# EAGLE design LDecNUC100_64_B (EAGLE 5.06)

## Sheet 1 of 3
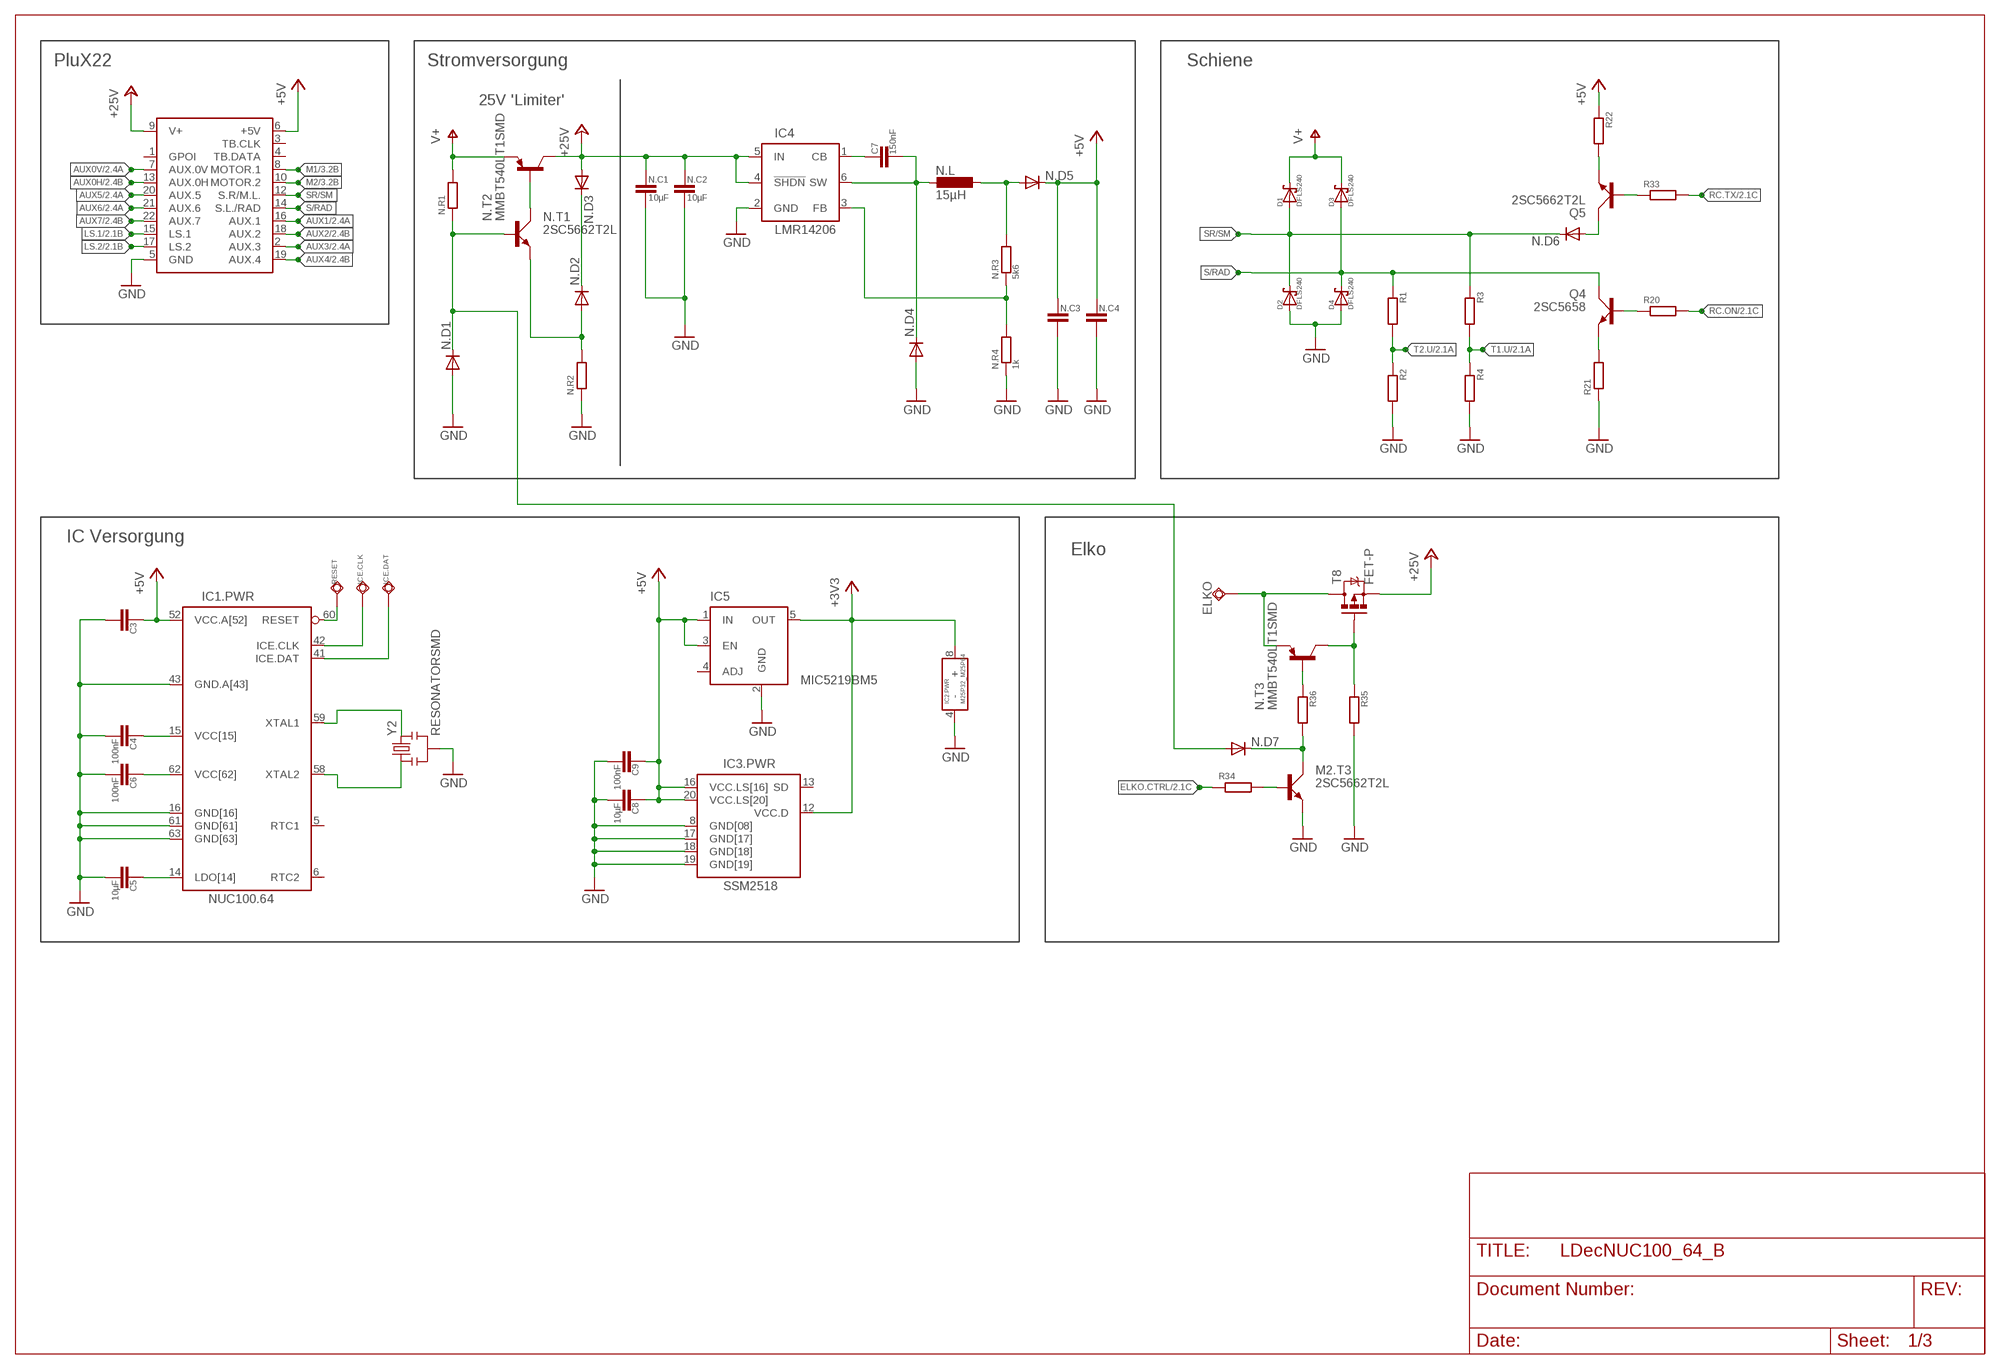
[diagram p0: schematic, sheet 1]

### Parts
C3  C-EUC0402  [C0402]
C4  100nF  C-EUC0402  [C0402]
C5  10µF  C-EUC0603  [C0603]
C6  100nF  C-EUC0402  [C0402]
C7  150nF  C-EUC0402  [C0402]
C8  10µF  C-EUC0603  [C0603]
C9  100nF  C-EUC0402  [C0402]
D1  DFLS240  [DFLS]
D2  DFLS240  [DFLS]
D3  DFLS240  [DFLS]
D4  DFLS240  [DFLS]
ELKO  TPSQTP08SQ  [TP08SQ]
IC1  NUC100.64  NUC100.6410X10  [LPQFP64.10X10]
IC2  M25P32_M25P64  [MLP08]
IC3  SSM2518  [LFCP20]
IC4  LMR14206  [SOT23-6]
IC5  MIC5219BM5  [SOT23-5]
ICE.CLK  TPSQTP08SQ  [TP08SQ]
ICE.DAT  TPSQTP08SQ  [TP08SQ]
M2.T3  2SC5662T2L  [VMT3]
N.C1  10µF  C-EUC1210  [C1210]
N.C2  10µF  C-EUC1210  [C1210]
N.C3  C-EUC1210  [C1210]
N.C4  C-EUC1210  [C1210]
N.D1  DIODE-MICROMELF-W  [MICROMELF-W]
N.D2  DIODE-SOD523  [SOD523]
N.D3  DIODE-SOD523  [SOD523]
N.D4  DIODE-SOD523  [SOD523]
N.D5  DIODE-SOD523  [SOD523]
N.D6  DIODE-SOD523  [SOD523]
N.D7  DIODE-SOD523  [SOD523]
N.L  15µH  L-EUL2825P  [L2825P]
N.R1  R-EU_R0402  [R0402]
N.R2  R-EU_R0402  [R0402]
N.R3  5k6  R-EU_R0402  [R0402]
N.R4  1k  R-EU_R0402  [R0402]
N.T1  2SC5662T2L  [VMT3]
N.T2  MMBT540LT1SMD  [SOT23-BEC]
N.T3  MMBT540LT1SMD  [SOT23-BEC]
Q4  2SC5658  2SC3838T146  [SC59]
Q5  2SC5662T2L  [VMT3]
R1  R-EU_R0402  [R0402]
R2  R-EU_R0402  [R0402]
R3  R-EU_R0402  [R0402]
R4  R-EU_R0402  [R0402]
R20  R-EU_R0402  [R0402]
R21  R-EU_R0402  [R0402]
R22  R-EU_R0402  [R0402]
R33  R-EU_R0402  [R0402]
R34  R-EU_R0402  [R0402]
R35  R-EU_R0402  [R0402]
R36  R-EU_R0402  [R0402]
RESET  TPSQTP08SQ  [TP08SQ]
T8  FET-P  [SOT23-3]
X1  X-PLUX22  [X-PLUX22]
Y2  RESONATORSMD  [RESONATOR-SMD]

### Nets
+3V3: IC2.8(.PWR:+) IC3.12(.PWR:VCC.D) IC5.5(OUT)
+5V: C3.1 C8.1 C9.1 IC1.52(.PWR:VCC.A[52]) IC3.16(.PWR:VCC.LS[16]) IC3.20(.PWR:VCC.LS[20]) IC5.1(IN) IC5.3(EN) N.C3.1 N.C4.1 N.D5.C R22.1 X1.6(+5V) ; also sheet 2
+24V: IC4.4(!SHDN) IC4.5(IN) N.C1.1 N.C2.1 N.D3.A N.T2.C T8.2(S) X1.9(V+) ; supply symbol labelled +25V ; also sheet 3
AUX0H: X1.13(AUX.0H) ; also sheet 2
AUX0V: X1.7(AUX.0V) ; also sheet 2
AUX1: X1.16(AUX.1) ; also sheet 2
AUX2: X1.18(AUX.2) ; also sheet 2
AUX3: X1.2(AUX.3) ; also sheet 2
AUX4: X1.19(AUX.4) ; also sheet 2
AUX5: X1.20(AUX.5) ; also sheet 2
AUX6: X1.21(AUX.6) ; also sheet 2
AUX7: X1.22(AUX.7) ; also sheet 2
ELKO: ELKO.TP N.T3.E T8.3(D)
ELKO.CTRL: R34.1 ; also sheet 2
GND: C3.2 C4.2 C5.2 C6.2 C8.2 C9.2 D2.A D4.A IC1.16(.PWR:GND[16]) IC1.43(.PWR:GND.A[43]) IC1.61(.PWR:GND[61]) IC1.63(.PWR:GND[63]) IC2.4(.PWR:-) IC3.8(.PWR:GND[08]) IC3.17(.PWR:GND[17]) IC3.18(.PWR:GND[18]) IC3.19(.PWR:GND[19]) IC4.2(GND) IC5.2(GND) M2.T3.E N.C1.2 N.C2.2 N.C3.2 N.C4.2 N.D1.A N.D4.A N.R2.1 N.R4.1 R2.2 R4.2 R21.1 R35.2 X1.5(GND) Y2.2 ; also sheet 2,3
LS.1: X1.15(LS.1) ; also sheet 2
LS.2: X1.17(LS.2) ; also sheet 2
M1: X1.8(MOTOR.1) ; also sheet 3
M2: X1.10(MOTOR.2) ; also sheet 3
N$5: IC1.58(.PWR:XTAL2) Y2.1
N$19: C4.1 IC1.15(.PWR:VCC[15])
N$22: IC1.60(.PWR:RESET) RESET.TP
N$23: IC1.42(.PWR:ICE.CLK) ICE.CLK.TP
N$25: IC1.41(.PWR:ICE.DAT) ICE.DAT.TP
N$28: C7.1 IC4.1(CB)
N$29: N.T1.C N.T2.B
N$31: N.D1.C N.D7.A N.R1.1 N.T1.B
N$32: N.D2.C N.D3.C
N$33: N.D2.A N.R2.2 N.T1.E
N$34: N.D5.A N.L.1 N.R3.2
N$36: IC4.3(FB) N.R3.1 N.R4.2
N$37: C6.1 IC1.62(.PWR:VCC[62])
N$48: C7.2 IC4.6(SW) N.D4.C N.L.2
N$54: C5.1 IC1.14(.PWR:LDO[14])
N$56: IC1.59(.PWR:XTAL1) Y2.3
N$64: Q4.E R21.2
N$65: Q4.B R20.1
N$66: N.D6.A Q5.C
N$67: Q5.E R22.2
N$68: Q5.B R33.1
N$69: M2.T3.B R34.2
N$70: N.T3.C R35.1 T8.1(G)
N$71: N.T3.B R36.1
N$72: M2.T3.C N.D7.C R36.2
RC.ON: R20.2 ; also sheet 2
RC.TX: R33.2 ; also sheet 2
S/RAD: D3.A D4.K(C) Q4.C R1.1 X1.14(S.L./RAD)
SR/SM: D1.A D2.K(C) N.D6.C R3.1 X1.12(S.R/M.L.)
T1.U: R3.2 R4.1 ; also sheet 2
T2.U: R1.2 R2.1 ; also sheet 2
V+: D1.K(C) D3.K(C) N.R1.2 N.T2.E
Unconnected: IC1.5(.PWR:RTC1) IC1.6(.PWR:RTC2) IC3.13(.PWR:SD) IC5.4(ADJ) X1.1(GPOI) X1.3(TB.CLK) X1.4(TB.DATA)

### Notes on the sheet
- PluX22 | Stromversorgung | Schiene
- 25V 'Limiter'
- IC Versorgung
- Elko

## Sheet 2 of 3
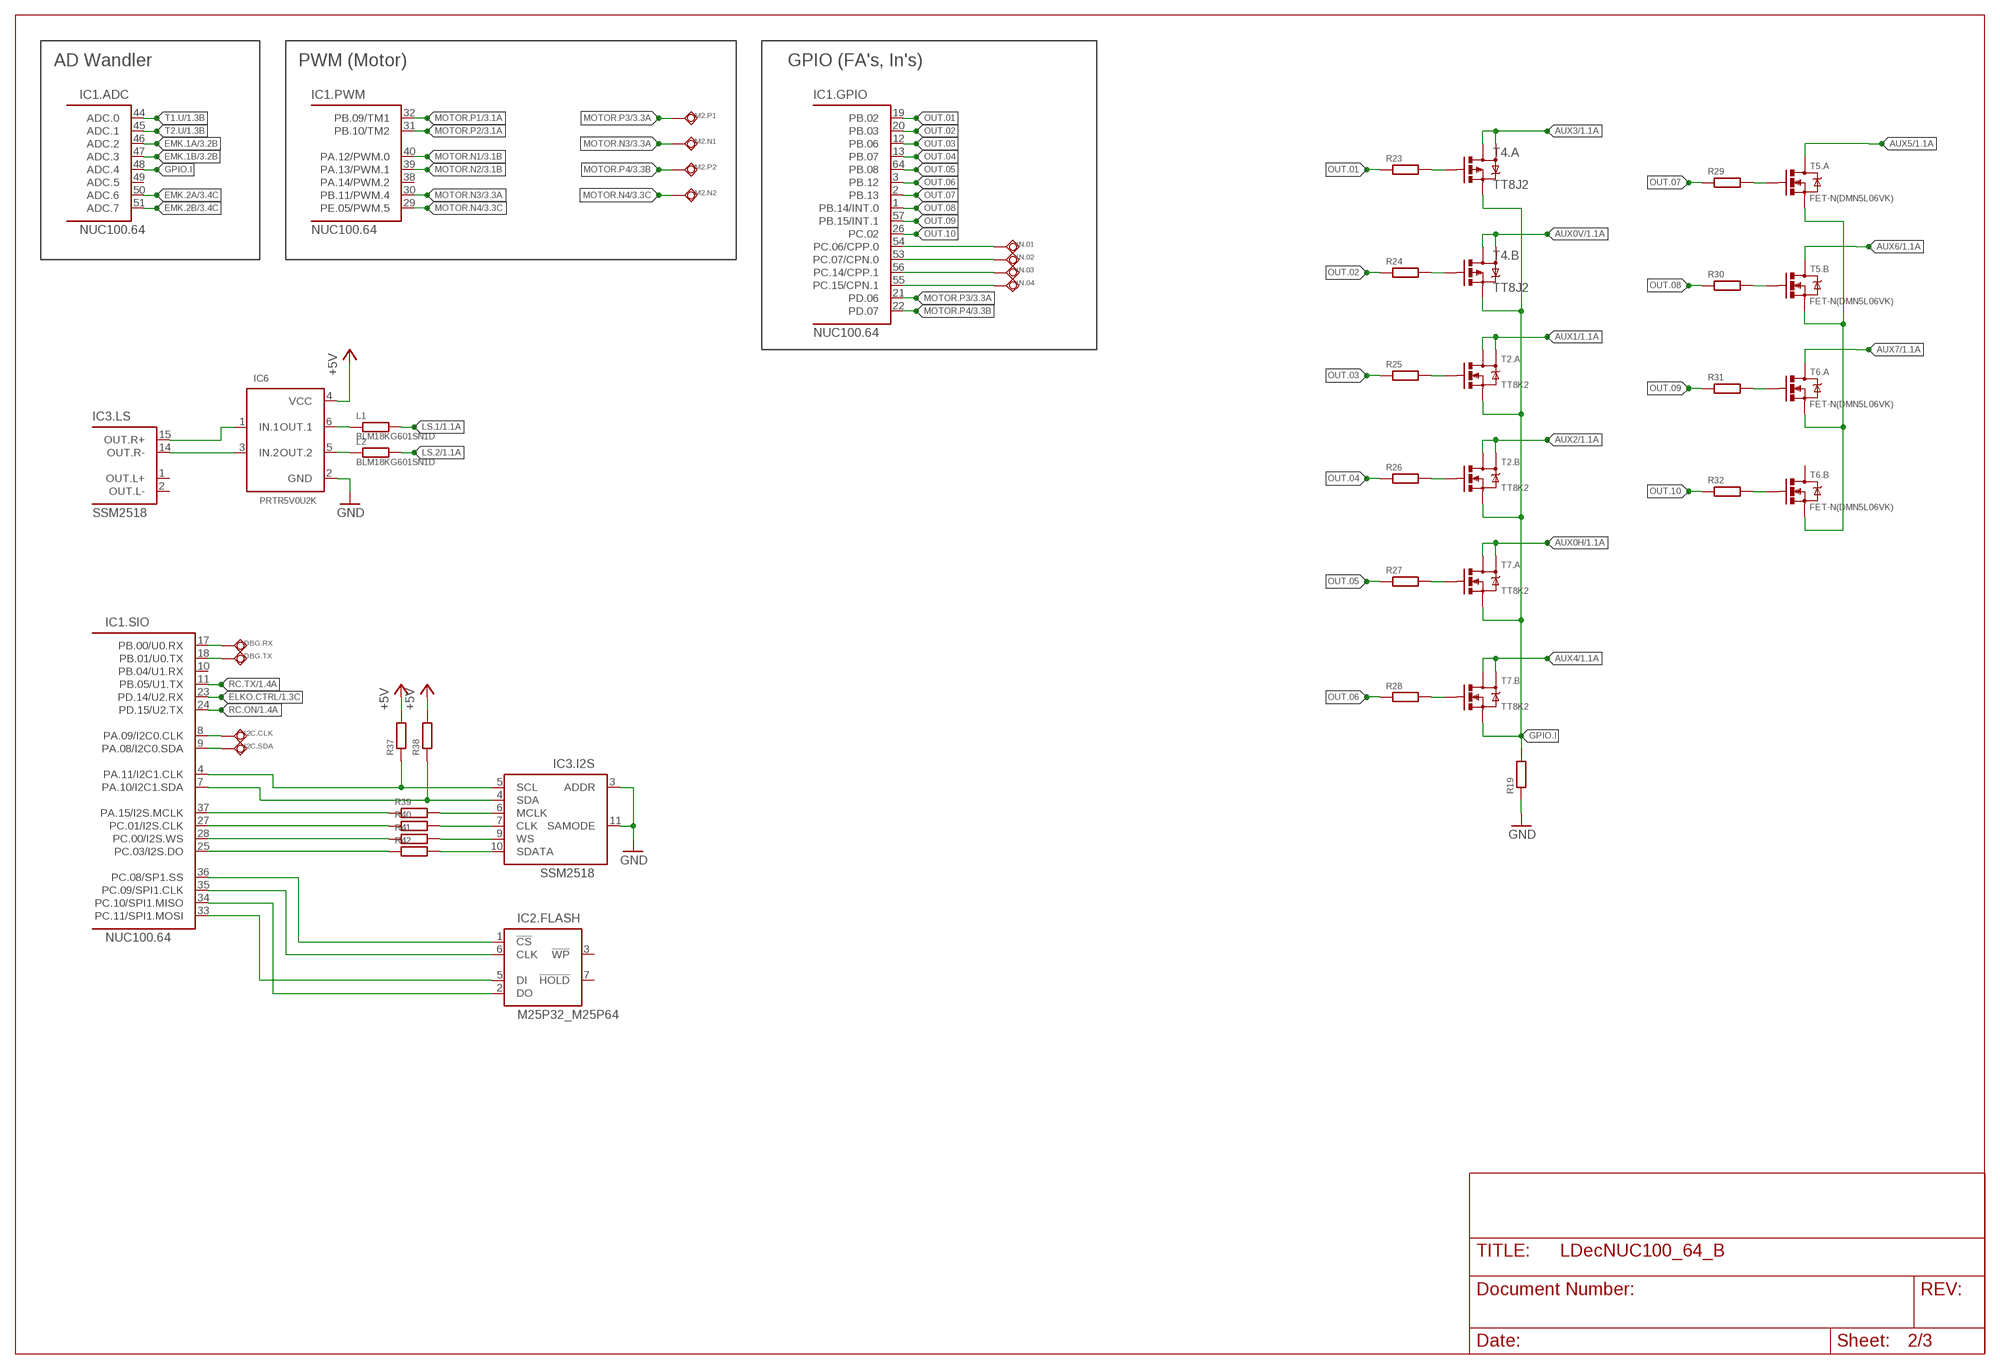
[diagram p1: schematic, sheet 2]

### Parts
DBG.RX  TPSQTP08SQ  [TP08SQ]
DBG.TX  TPSQTP08SQ  [TP08SQ]
I2C.CLK  TPSQTP08SQ  [TP08SQ]
I2C.SDA  TPSQTP08SQ  [TP08SQ]
IC6  PRTR5V0U2K  [SOT666]
IN.01  TPSQTP08SQ  [TP08SQ]
IN.02  TPSQTP08SQ  [TP08SQ]
IN.03  TPSQTP08SQ  [TP08SQ]
IN.04  TPSQTP08SQ  [TP08SQ]
L1  BLM18KG601SN1D  R-EU_R0603  [R0603]
L2  BLM18KG601SN1D  R-EU_R0603  [R0603]
M2.N1  TPSQTP08SQ  [TP08SQ]
M2.N2  TPSQTP08SQ  [TP08SQ]
M2.P1  TPSQTP08SQ  [TP08SQ]
M2.P2  TPSQTP08SQ  [TP08SQ]
R19  R-EU_R0805  [R0805]
R23  R-EU_R0402  [R0402]
R24  R-EU_R0402  [R0402]
R25  R-EU_R0402  [R0402]
R26  R-EU_R0402  [R0402]
R27  R-EU_R0402  [R0402]
R28  R-EU_R0402  [R0402]
R29  R-EU_R0402  [R0402]
R30  R-EU_R0402  [R0402]
R31  R-EU_R0402  [R0402]
R32  R-EU_R0402  [R0402]
R37  R-EU_R0402  [R0402]
R38  R-EU_R0402  [R0402]
R39  R-EU_R0402  [R0402]
R40  R-EU_R0402  [R0402]
R41  R-EU_R0402  [R0402]
R42  R-EU_R0402  [R0402]
T2  TT8K2  [TSST8]
T4  TT8J2  [TSST8]
T5  FET-N(DMN5L06VK)  [SOT-563]
T6  FET-N(DMN5L06VK)  [SOT-563]
T7  TT8K2  [TSST8]

### Nets
+5V: IC6.4(VCC) R37.2 R38.2 ; also sheet 1
AUX0H: T7.7(.A:D1) T7.8(.A:D2) ; also sheet 1
AUX0V: T4.5(.B:D1) T4.6(.B:D2) ; also sheet 1
AUX1: T2.7(.A:D1) T2.8(.A:D2) ; also sheet 1
AUX2: T2.5(.B:D1) T2.6(.B:D2) ; also sheet 1
AUX3: T4.7(.A:D1) T4.8(.A:D2) ; also sheet 1
AUX4: T7.5(.B:D1) T7.6(.B:D2) ; also sheet 1
AUX5: T5.4(.A:D) ; also sheet 1
AUX6: T5.1(.B:D) ; also sheet 1
AUX7: T6.4(.A:D) ; also sheet 1
ELKO.CTRL: IC1.23(.SIO:PD.14/U2.RX) ; also sheet 1
EMK.1A: IC1.46(.ADC:ADC.2) ; also sheet 3
EMK.1B: IC1.47(.ADC:ADC.3) ; also sheet 3
EMK.2A: IC1.50(.ADC:ADC.6) ; also sheet 3
EMK.2B: IC1.51(.ADC:ADC.7) ; also sheet 3
GND: IC3.3(.I2S:ADDR) IC3.11(.I2S:SAMODE) IC6.2(GND) R19.1 ; also sheet 1,3
GPIO.I: IC1.48(.ADC:ADC.4) R19.2 T2.1(.A:S) T2.3(.B:S) T4.1(.A:S) T4.3(.B:S) T7.1(.A:S) T7.3(.B:S)
LS.1: L1.2 ; also sheet 1
LS.2: L2.2 ; also sheet 1
MOTOR.N1: IC1.40(.PWM:PA.12/PWM.0) ; also sheet 3
MOTOR.N2: IC1.39(.PWM:PA.13/PWM.1) ; also sheet 3
MOTOR.N3: IC1.30(.PWM:PB.11/PWM.4) M2.N1.TP ; also sheet 3
MOTOR.N4: IC1.29(.PWM:PE.05/PWM.5) M2.N2.TP ; also sheet 3
MOTOR.P1: IC1.32(.PWM:PB.09/TM1) ; also sheet 3
MOTOR.P2: IC1.31(.PWM:PB.10/TM2) ; also sheet 3
MOTOR.P3: IC1.21(.GPIO:PD.06) M2.P1.TP ; also sheet 3
MOTOR.P4: IC1.22(.GPIO:PD.07) M2.P2.TP ; also sheet 3
N$1: IC1.36(.SIO:PC.08/SP1.SS) IC2.1(.FLASH:!CS)
N$2: IC1.35(.SIO:PC.09/SPI1.CLK) IC2.6(.FLASH:CLK)
N$3: IC1.34(.SIO:PC.10/SPI1.MISO) IC2.2(.FLASH:DO)
N$4: IC1.33(.SIO:PC.11/SPI1.MOSI) IC2.5(.FLASH:DI)
N$6: R23.2 T4.2(.A:G)
N$7: R24.2 T4.4(.B:G)
N$8: R25.2 T2.2(.A:G)
N$9: R26.2 T2.4(.B:G)
N$10: R27.2 T7.2(.A:G)
N$18: R28.2 T7.4(.B:G)
N$26: DBG.TX.TP IC1.18(.SIO:PB.01/U0.TX)
N$27: I2C.CLK.TP IC1.8(.SIO:PA.09/I2C0.CLK)
N$35: I2C.SDA.TP IC1.9(.SIO:PA.08/I2C0.SDA)
N$38: DBG.RX.TP IC1.17(.SIO:PB.00/U0.RX)
N$39: IC3.6(.I2S:MCLK) R39.2
N$40: IC3.7(.I2S:CLK) R40.2
N$41: T5.3(.A:S) T5.6(.B:S) T6.3(.A:S) T6.6(.B:S)
N$42: R31.2 T6.2(.A:G)
N$43: R32.2 T6.5(.B:G)
N$44: R29.2 T5.2(.A:G)
N$45: R30.2 T5.5(.B:G)
N$46: IC3.9(.I2S:WS) R41.2
N$47: IC3.10(.I2S:SDATA) R42.2
N$49: IC1.7(.SIO:PA.10/I2C1.SDA) IC3.4(.I2S:SDA) R38.1
N$50: IC1.4(.SIO:PA.11/I2C1.CLK) IC3.5(.I2S:SCL) R37.1
N$55: IC1.54(.GPIO:PC.06/CPP.0) IN.01.TP
N$57: IC1.53(.GPIO:PC.07/CPN.0) IN.02.TP
N$58: IC1.56(.GPIO:PC.14/CPP.1) IN.03.TP
N$59: IC1.55(.GPIO:PC.15/CPN.1) IN.04.TP
N$60: IC3.14(.LS:OUT.R-) IC6.3(IN.2)
N$61: IC3.15(.LS:OUT.R+) IC6.1(IN.1)
N$62: IC6.5(OUT.2) L2.1
N$63: IC6.6(OUT.1) L1.1
N$73: IC1.25(.SIO:PC.03/I2S.DO) R42.1
N$74: IC1.28(.SIO:PC.00/I2S.WS) R41.1
N$75: IC1.27(.SIO:PC.01/I2S.CLK) R40.1
N$76: IC1.37(.SIO:PA.15/I2S.MCLK) R39.1
OUT.01: IC1.19(.GPIO:PB.02) R23.1
OUT.02: IC1.20(.GPIO:PB.03) R24.1
OUT.03: IC1.12(.GPIO:PB.06) R25.1
OUT.04: IC1.13(.GPIO:PB.07) R26.1
OUT.05: IC1.64(.GPIO:PB.08) R27.1
OUT.06: IC1.3(.GPIO:PB.12) R28.1
OUT.07: IC1.2(.GPIO:PB.13) R29.1
OUT.08: IC1.1(.GPIO:PB.14/INT.0) R30.1
OUT.09: IC1.57(.GPIO:PB.15/INT.1) R31.1
OUT.10: IC1.26(.GPIO:PC.02) R32.1
RC.ON: IC1.24(.SIO:PD.15/U2.TX) ; also sheet 1
RC.TX: IC1.11(.SIO:PB.05/U1.TX) ; also sheet 1
T1.U: IC1.44(.ADC:ADC.0) ; also sheet 1
T2.U: IC1.45(.ADC:ADC.1) ; also sheet 1
Unconnected: IC1.10(.SIO:PB.04/U1.RX) IC1.38(.PWM:PA.14/PWM.2) IC1.49(.ADC:ADC.5) IC2.3(.FLASH:!WP) IC2.7(.FLASH:!HOLD) IC3.1(.LS:OUT.L+) IC3.2(.LS:OUT.L-) T6.1(.B:D)

### Notes on the sheet
- AD Wandler | PWM (Motor) | GPIO (FA's, In's)

## Sheet 3 of 3
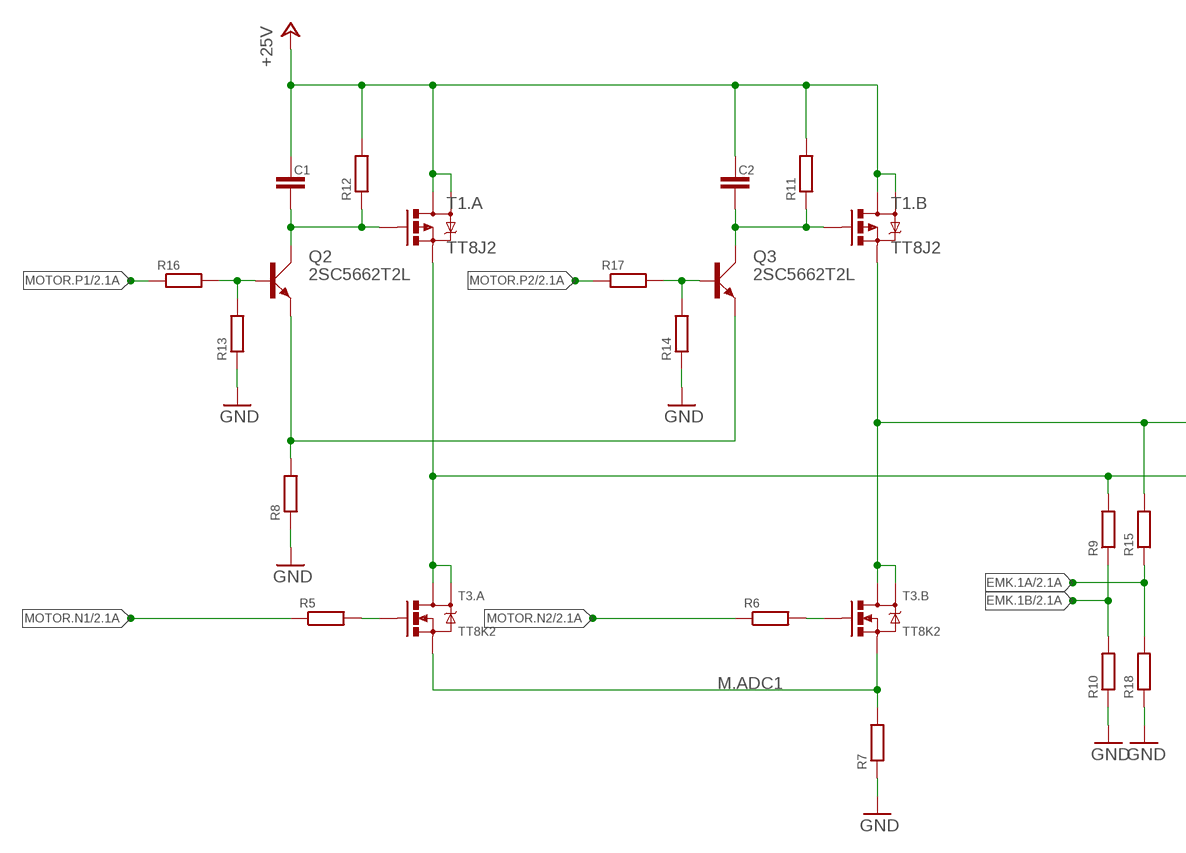
[diagram p2: schematic, sheet 3, part 1 of 2]
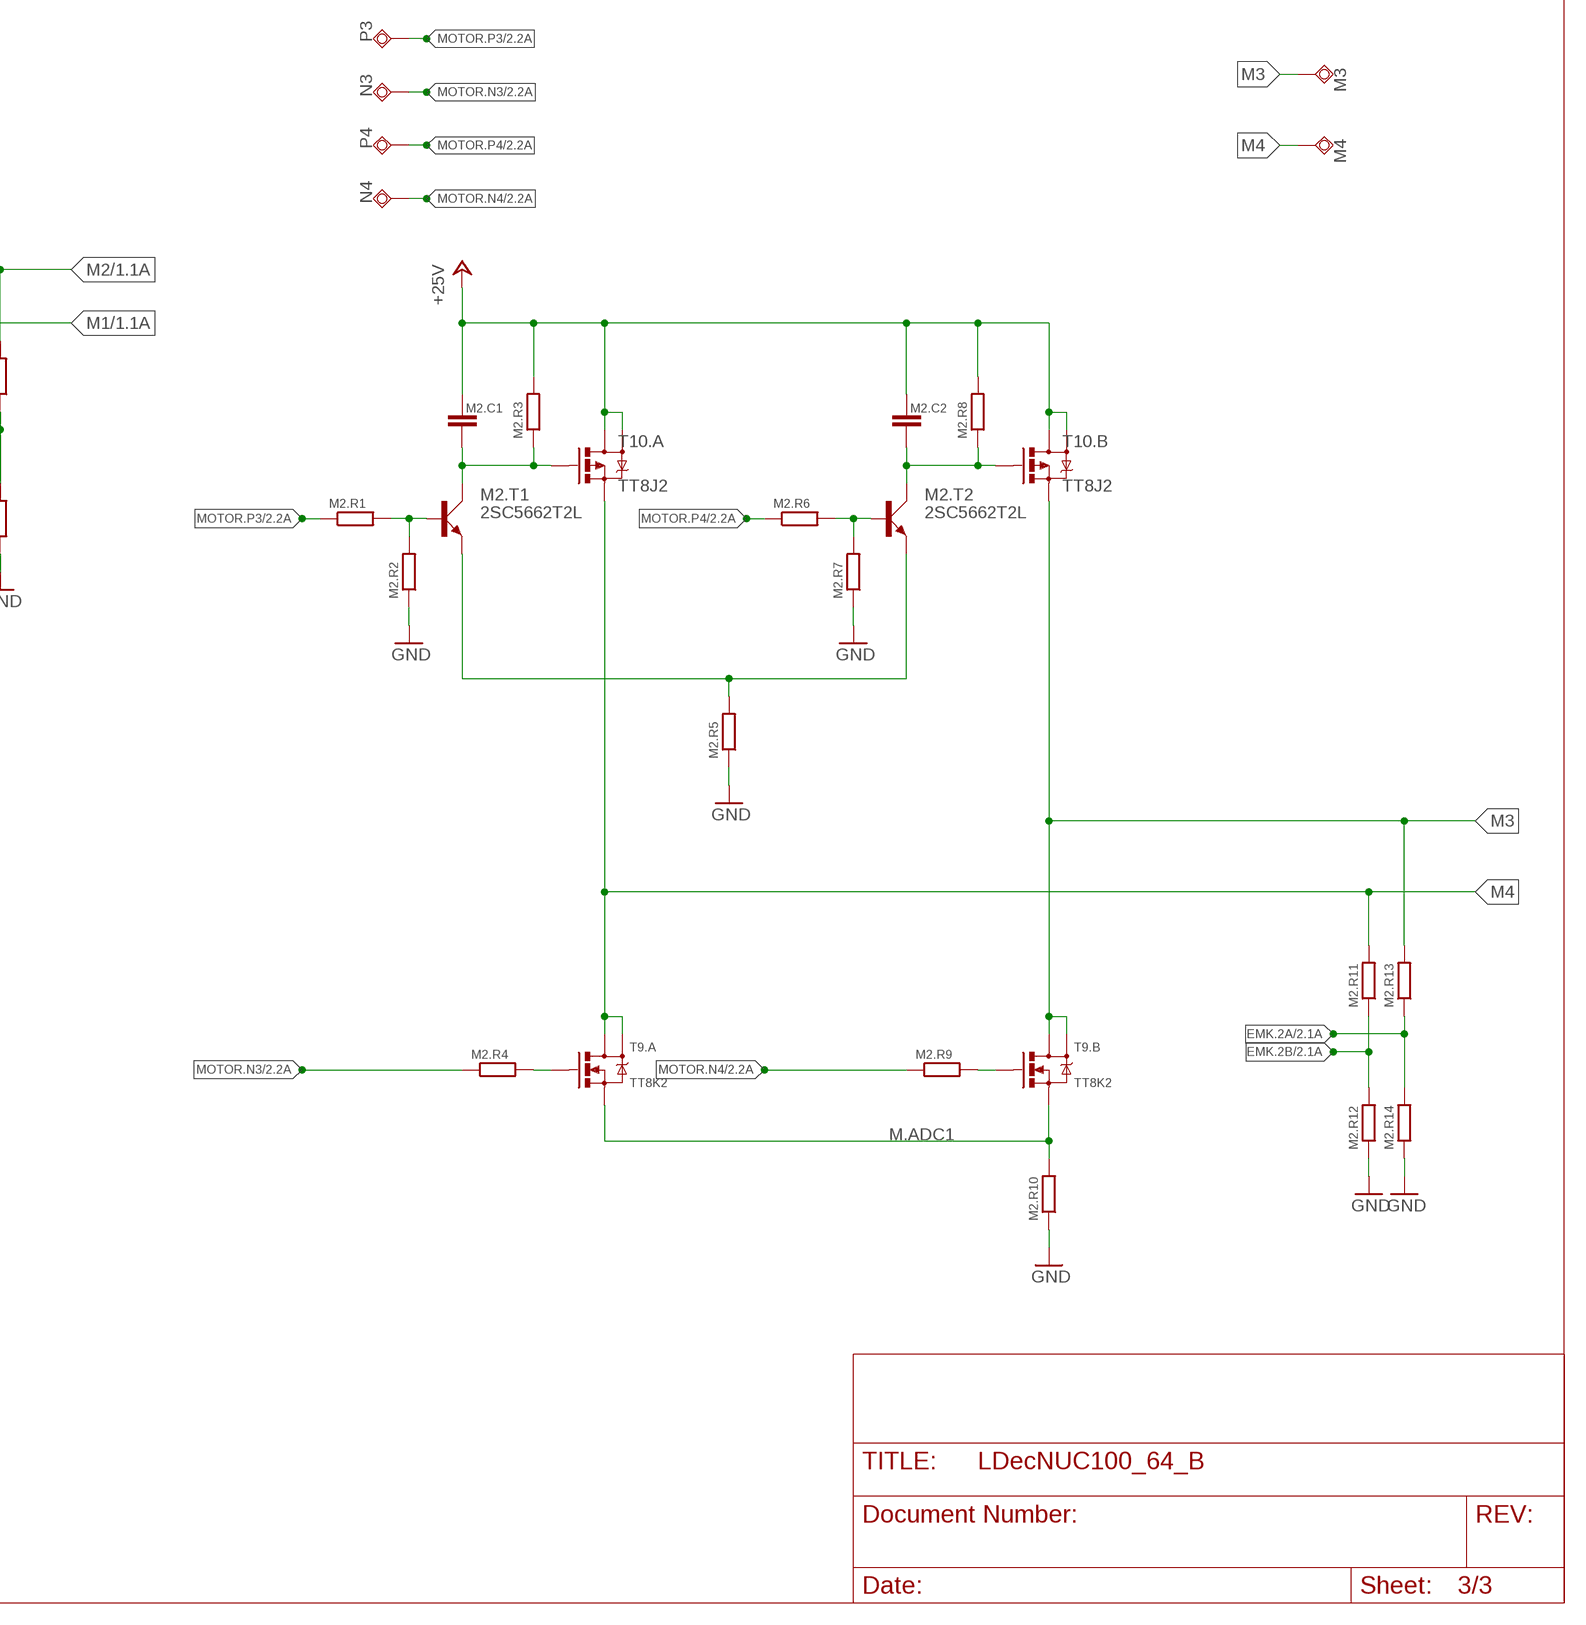
[diagram p3: schematic, sheet 3, part 2 of 2]

### Parts
C1  C-EUC0402  [C0402]
C2  C-EUC0402  [C0402]
M2.C1  C-EUC0402  [C0402]
M2.C2  C-EUC0402  [C0402]
M2.R1  R-EU_R0402  [R0402]
M2.R2  R-EU_R0402  [R0402]
M2.R3  R-EU_R0402  [R0402]
M2.R4  R-EU_R0402  [R0402]
M2.R5  R-EU_R0402  [R0402]
M2.R6  R-EU_R0402  [R0402]
M2.R7  R-EU_R0402  [R0402]
M2.R8  R-EU_R0402  [R0402]
M2.R9  R-EU_R0402  [R0402]
M2.R10  R-EU_R0805  [R0805]
M2.R11  R-EU_R0402  [R0402]
M2.R12  R-EU_R0402  [R0402]
M2.R13  R-EU_R0402  [R0402]
M2.R14  R-EU_R0402  [R0402]
M2.T1  2SC5662T2L  [VMT3]
M2.T2  2SC5662T2L  [VMT3]
M3  TPSQTP08SQ  [TP08SQ]
M4  TPSQTP08SQ  [TP08SQ]
N3  TPSQTP08SQ  [TP08SQ]
N4  TPSQTP08SQ  [TP08SQ]
P3  TPSQTP08SQ  [TP08SQ]
P4  TPSQTP08SQ  [TP08SQ]
Q2  2SC5662T2L  [VMT3]
Q3  2SC5662T2L  [VMT3]
R5  R-EU_R0402  [R0402]
R6  R-EU_R0402  [R0402]
R7  R-EU_R0805  [R0805]
R8  R-EU_R0402  [R0402]
R9  R-EU_R0402  [R0402]
R10  R-EU_R0402  [R0402]
R11  R-EU_R0402  [R0402]
R12  R-EU_R0402  [R0402]
R13  R-EU_R0402  [R0402]
R14  R-EU_R0402  [R0402]
R15  R-EU_R0402  [R0402]
R16  R-EU_R0402  [R0402]
R17  R-EU_R0402  [R0402]
R18  R-EU_R0402  [R0402]
T1  TT8J2  [TSST8]
T3  TT8K2  [TSST8]
T9  TT8K2  [TSST8]
T10  TT8J2  [TSST8]

### Nets
+24V: C1.1 C2.1 M2.C1.1 M2.C2.1 M2.R3.2 M2.R8.2 R11.2 R12.2 T1.5(.B:D1) T1.6(.B:D2) T1.7(.A:D1) T1.8(.A:D2) T10.5(.B:D1) T10.6(.B:D2) T10.7(.A:D1) T10.8(.A:D2) ; supply symbol labelled +25V ; also sheet 1
EMK.1A: R15.1 R18.2 ; also sheet 2
EMK.1B: R9.1 R10.2 ; also sheet 2
EMK.2A: M2.R13.1 M2.R14.2 ; also sheet 2
EMK.2B: M2.R11.1 M2.R12.2 ; also sheet 2
GND: M2.R2.1 M2.R5.1 M2.R7.1 M2.R10.1 M2.R12.1 M2.R14.1 R7.1 R8.1 R10.1 R13.1 R14.1 R18.1 ; also sheet 1,2
M1: R9.2 T1.1(.A:S) T3.7(.A:D1) T3.8(.A:D2) ; also sheet 1
M2: R15.2 T1.3(.B:S) T3.5(.B:D1) T3.6(.B:D2) ; also sheet 1
M3: M2.R13.2 M3.TP T9.5(.B:D1) T9.6(.B:D2) T10.3(.B:S)
M4: M2.R11.2 M4.TP T9.7(.A:D1) T9.8(.A:D2) T10.1(.A:S)
M.ADC1: M2.R10.2 R7.2 T3.1(.A:S) T3.3(.B:S) T9.1(.A:S) T9.3(.B:S)
MOTOR.N1: R5.1 ; also sheet 2
MOTOR.N2: R6.1 ; also sheet 2
MOTOR.N3: M2.R4.1 N3.TP ; also sheet 2
MOTOR.N4: M2.R9.1 N4.TP ; also sheet 2
MOTOR.P1: R16.1 ; also sheet 2
MOTOR.P2: R17.1 ; also sheet 2
MOTOR.P3: M2.R1.1 P3.TP ; also sheet 2
MOTOR.P4: M2.R6.1 P4.TP ; also sheet 2
N$11: C1.2 Q2.C R12.1 T1.2(.A:G)
N$12: C2.2 Q3.C R11.1 T1.4(.B:G)
N$13: M2.R4.2 T9.2(.A:G)
N$14: Q2.E Q3.E R8.2
N$15: Q2.B R13.2 R16.2
N$16: Q3.B R14.2 R17.2
N$17: M2.R9.2 T9.4(.B:G)
N$20: R5.2 T3.2(.A:G)
N$21: R6.2 T3.4(.B:G)
N$24: M2.C1.2 M2.R3.1 M2.T1.C T10.2(.A:G)
N$30: M2.C2.2 M2.R8.1 M2.T2.C T10.4(.B:G)
N$51: M2.R5.2 M2.T1.E M2.T2.E
N$52: M2.R1.2 M2.R2.2 M2.T1.B
N$53: M2.R6.2 M2.R7.2 M2.T2.B

## Library data of the parts
C1-C9 M2.C1 M2.C2 N.C1-N.C4 = ZS_R_C_L:C-EU: CAPACITOR, European symbol
D1-D4 = ZS_R_C_L:DFLS240
DBG.RX DBG.TX I2C.CLK I2C.SDA ICE.CLK ICE.DAT IN.01-IN.04 M2.N1 M2.N2 M2.P1 M2.P2 RESET = ZS_Power:TPSQ: Test pad
ELKO M3 M4 N3 N4 P3 P4 = testpad:TPSQ: Test pad
IC1 = NUC130:NUC100.64
IC2 = ZS_SimpelIC:M25P32_M25P64
IC3 = ZS_I2C_I2S:SSM2518
IC4 = ZS_Power:LMR14206: 600mA
IC5 = v-reg-micrel:MIC5219BM5: VOLTAGE REGULATOR
IC6 = ZS_R_C_L:PRTR5V0U2K
L1 L2 M2.R1-M2.R14 N.R1-N.R4 R1-R42 = ZS_R_C_L:R-EU_: RESISTOR, European symbol
M2.T1-M2.T3 N.T1 Q2 Q3 Q5 = transistor-small-signal:2SC5662: High-Frequency Amplifier Transistor 11V, 50mA, 3.2GHz (Rohm)
N.D1-N.D7 = diode:DIODE-: DIODE
N.L = ZS_R_C_L:L-EU: INDUCTOR, European symbol
N.T2 N.T3 = transistor-pnp:MMBT540*: PNP Transistror
Q4 = transistor-small-signal:2SC3838: High-Frequency Amplifier Transistor 11V, 50mA, 3.2GHz (Rohm)
T1 T4 T10 = ZS_R_C_L:TT8J2
T2 T3 T7 T9 = ZS_R_C_L:TT8K2
T5 T6 = ZS_R_C_L:FET-N(DMN5L06VK)
T8 = ZS_R_C_L:FET-P: P-Channel FET, SOT23-3
X1 = ZS_Connector:X-PLUX22
Y2 = SparkFun:RESONATOR: Resonator Small SMD resonator. This is the itty bitty 10/20MHz resonators with built in caps. CSTCE10M0G55 and CSTCE20M0V53. Footprint has been reviewed closely but hasn't been tested yet.

## Board
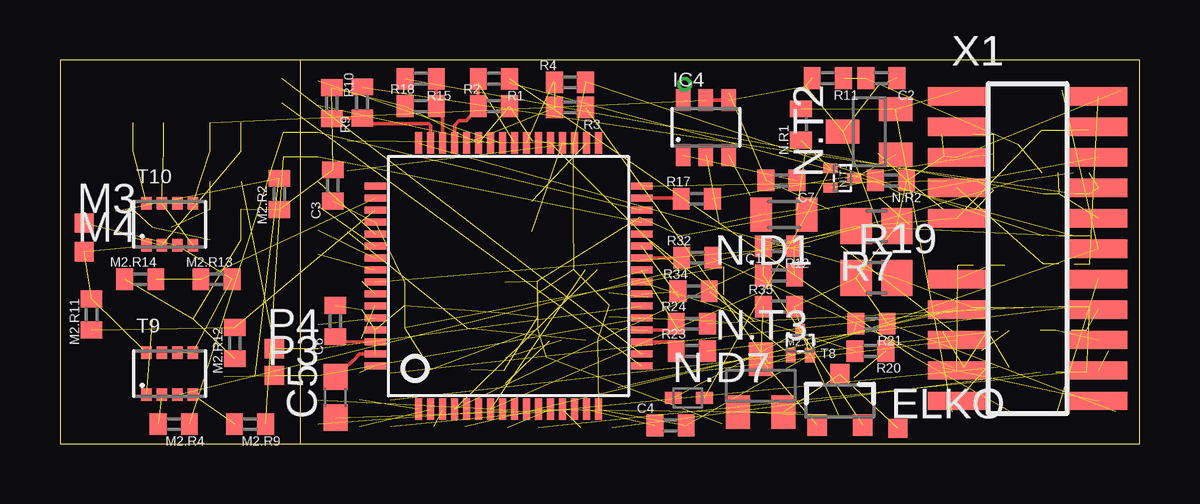
[diagram p4: board, top side]
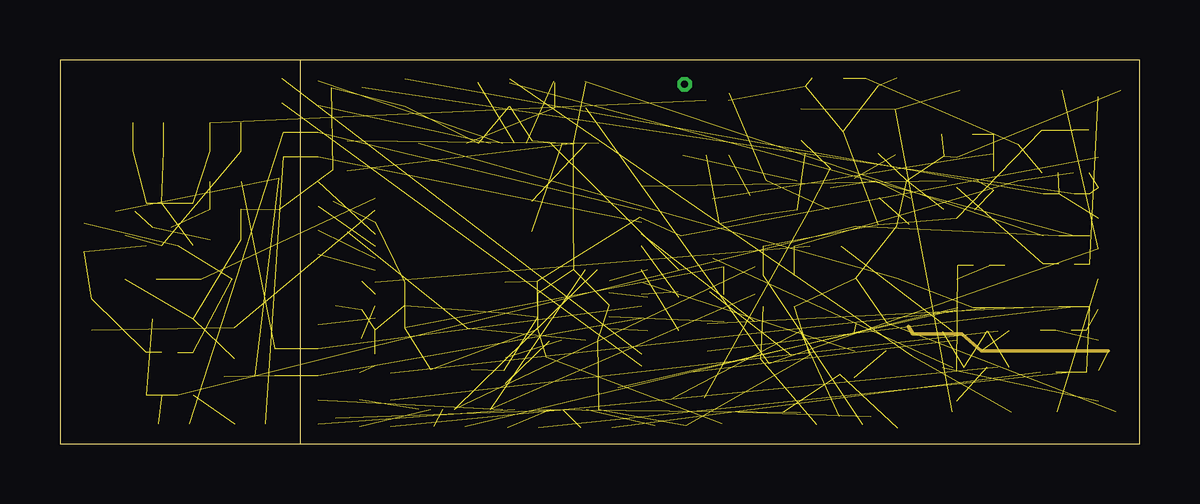
[diagram p5: board, inner layer Route15]
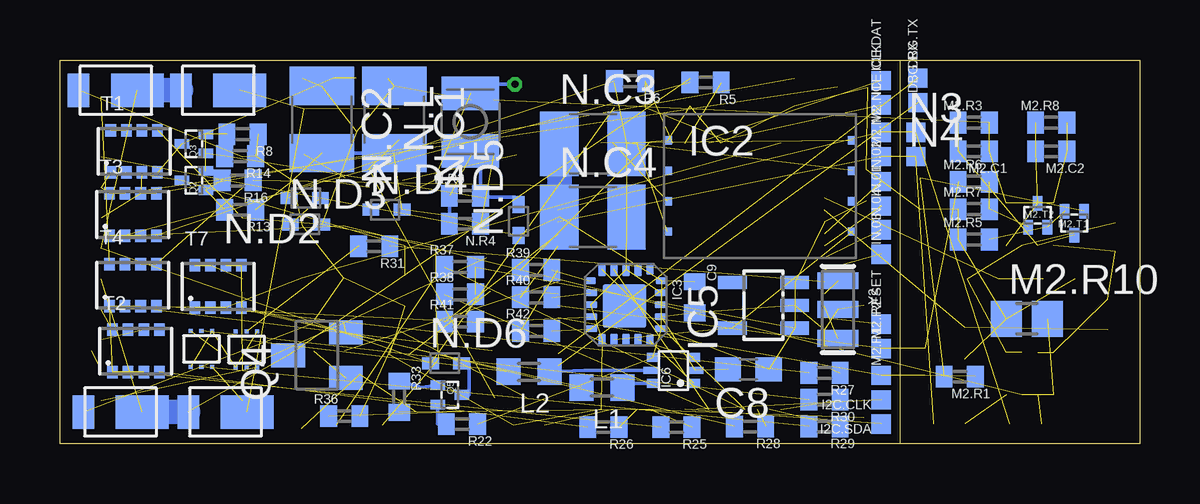
[diagram p6: board, bottom side, seen from below]

Size 45 x 16 mm. Coordinates in mm from the lower left corner, seen from the top.
Outline: 10,0 0,0 0,16 10,16
Outline: 10,0 45,0 45,16 10,16
Outline: 10,16 10,0
Copper layers ((1*2)+(15*16)): Top 0.035mm / dielectric 1.5mm / Route2 0.035mm / dielectric 0.15mm / Route15 0.035mm / dielectric 0.2mm / Bottom 0.035mm
Design rules "default": minimum track width 6mil, minimum drill 12mil, track to track 8mil, track to pad 8mil, pad to pad 6mil, via to via 8mil, smd to smd 6mil, copper to edge 40mil, drill to drill 8mil, minimum pad ring 6mil, minimum via ring 6mil, stop-mask expansion 4mil, vias tented up to drill 0mil, thermal gap 10mil

### Footprints (pad centres in the part's own frame; a part is rotated, then mirrored left to right if it is on the bottom)
C0402 = smd 0.7 x 0.9: 1 -0.65,0; 2 0.65,0
C0603 = smd 1.1 x 1: 1 -0.85,0; 2 0.85,0
DFLS = smd 0.9 x 1.4: A 1.55,0 | smd 2.2 x 1.4: K -0.9,0
TP08SQ = smd 0.8 x 0.8: TP 0,0
LPQFP64.10X10 = smd 0.9 x 0.3: 1 -5.55,3.75; 2 -5.55,3.25; 3 -5.55,2.75; 4 -5.55,2.25; 5 -5.55,1.75; 6 -5.55,1.25; 7 -5.55,0.75; 8 -5.55,0.25; 9 -5.55,-0.25; 10 -5.55,-0.75; 11 -5.55,-1.25; 12 -5.55,-1.75; 13 -5.55,-2.25; 14 -5.55,-2.75; 15 -5.55,-3.25; 16 -5.55,-3.75; 33 5.55,-3.75; 34 5.55,-3.25; 35 5.55,-2.75; 36 5.55,-2.25; 37 5.55,-1.75; 38 5.55,-1.25; 39 5.55,-0.75; 40 5.55,-0.25; 41 5.55,0.25; 42 5.55,0.75; 43 5.55,1.25; 44 5.55,1.75; 45 5.55,2.25; 46 5.55,2.75; 47 5.55,3.25; 48 5.55,3.75 | smd 0.3 x 0.9: 17 -3.75,-5.55; 18 -3.25,-5.55; 19 -2.75,-5.55; 20 -2.25,-5.55; 21 -1.75,-5.55; 22 -1.25,-5.55; 23 -0.75,-5.55; 24 -0.25,-5.55; 25 0.25,-5.55; 26 0.75,-5.55; 27 1.25,-5.55; 28 1.75,-5.55; 29 2.25,-5.55; 30 2.75,-5.55; 31 3.25,-5.55; 32 3.75,-5.55; 49 3.75,5.55; 50 3.25,5.55; 51 2.75,5.55; 52 2.25,5.55; 53 1.75,5.55; 54 1.25,5.55; 55 0.75,5.55; 56 0.25,5.55; 57 -0.25,5.55; 58 -0.75,5.55; 59 -1.25,5.55; 60 -1.75,5.55; 61 -2.25,5.55; 62 -2.75,5.55; 63 -3.25,5.55; 64 -3.75,5.55
MLP08 = smd 0.35 x 0.35: 1 -3.85,-1.9; 2 -3.85,-0.635; 3 -3.85,0.635; 4 -3.85,1.9; 5 3.85,1.9; 6 3.85,0.635; 7 3.85,-0.635; 8 3.85,-1.9
LFCP20 = smd 0.5 x 0.3: 1 -1.55,0.95; 15 1.45,0.95 | smd 0.55 x 0.3: 2 -1.525,0.45; 3 -1.525,-0.05; 4 -1.525,-0.55; 5 -1.525,-1.05; 11 1.425,-1.05; 12 1.425,-0.55; 13 1.425,-0.05; 14 1.425,0.45 | smd 0.3 x 0.5: 6 -1.05,-1.55; 20 -1.05,1.45 | smd 0.3 x 0.55: 7 -0.55,-1.525; 8 -0.05,-1.525; 9 0.45,-1.525; 10 0.95,-1.525; 16 0.95,1.425; 17 0.45,1.425; 18 -0.05,1.425; 19 -0.55,1.425 | smd 1.8 x 1.8: EXP 0,-0.1
SOT23-6 = smd 0.6 x 0.9: 1 -0.95,-1.15; 2 0,-1.15; 3 0.95,-1.15; 4 0.95,1.15; 5 0,1.15; 6 -0.95,1.15
SOT23-5 = smd 0.55 x 1.2: 1 -0.95,-1.3; 2 0,-1.3; 3 0.95,-1.3; 4 0.95,1.3; 5 -0.95,1.3
SOT666 = smd 0.375 x 0.5: 1 -0.537,-0.85; 3 0.538,-0.85; 4 0.538,0.849; 6 -0.538,0.85 | smd 0.3 x 0.65: 2 0,-0.923; 5 0,0.925
R0603 = smd 1 x 1.1: 1 -0.85,0; 2 0.85,0
R0402 = smd 0.7 x 0.9: 1 -0.65,0; 2 0.65,0
R0805 = smd 1.3 x 1.5: 1 -0.85,0; 2 0.85,0
VMT3 = smd 0.4 x 0.6: B -0.4,-0.5; C 0,0.5; E 0.4,-0.5
C1210 = smd 1.6 x 2.7: 1 -1.4,0; 2 1.4,0
MICROMELF-W = smd 0.9 x 1.4: A 0.95,0; C -0.95,0
SOD523 = smd 0.7 x 0.5: A 0.7,0; C -0.6,0
L2825P = smd 1.4 x 2.4: 1 -1.2,0; 2 1.2,0
SOT23-BEC = smd 1 x 1.4: B -0.95,-1.1; C 0,1.1; E 0.95,-1.1
SC59 = smd 1 x 1.4: B -0.95,-1.2; C 0,1.2; E 0.95,-1.2
TSST8 = smd 0.44 x 0.52: 1 -0.975,-0.88; 2 -0.325,-0.88; 3 0.325,-0.88; 4 0.975,-0.88; 5 0.975,0.88; 6 0.325,0.88; 7 -0.325,0.88; 8 -0.975,0.88
SOT-563 = smd 0.17 x 0.17: 1 0.3,1.5; 2 0.75,1.5; 3 1.2,1.5; 4 1.2,0; 5 0.75,0; 6 0.3,0
SOT23-3 = smd 0.8 x 0.9: 1 -0.95,-1; 2 0.95,-1; 3 0,1.1
X-PLUX22 = smd 0.76 x 2.4: 1 -6.35,-2.95; 2 -6.35,2.95; 3 -5.08,-2.95; 4 -5.08,2.95; 5 -3.81,-2.95; 6 -3.81,2.95; 7 -2.54,-2.95; 8 -2.54,2.95; 9 -1.27,-2.95; 10 -1.27,2.95; 12 0,2.95; 13 1.27,-2.95; 14 1.27,2.95; 15 2.54,-2.95; 16 2.54,2.95; 17 3.81,-2.95; 18 3.81,2.95; 19 5.08,-2.95; 20 5.08,2.95; 21 6.35,-2.95; 22 6.35,2.95
RESONATOR-SMD = smd 0.7 x 1.7: 1 -1.2,0; 2 0,0; 3 1.2,0

### Placement (x,y rotation side)
C1  29.97,7.01 0 top
C2  34.24,15.24 180 top
C3  11.38,10.77 90 top
C4  25.45,0.76 0 top
C5  11.48,1.93 90 top
C6  11.48,5.11 90 top
C7  30.07,10.97 180 top
C8  16.31,3.1 180 bottom
C9  18.54,6.1 270 bottom
D1  38.4,14.73 180 bottom
D2  42.67,14.73 180 bottom
D3  38.1,1.32 180 bottom
D4  42.47,1.32 180 bottom
DBG.RX  9.25,14.22 0 bottom
DBG.TX  9.25,15.24 0 bottom
ELKO  34.92,0.64 0 top
I2C.CLK  10.77,1.83 90 bottom
I2C.SDA  10.77,0.81 90 bottom
IC1  18.69,6.99 90 top
IC2  15.82,10.74 0 bottom
IC3  21.36,5.74 270 bottom
IC4  26.92,13.18 0 top
IC5  15.67,5.77 90 bottom
IC6  19.43,3.05 90 bottom
ICE.CLK  10.77,14.12 0 bottom
ICE.DAT  10.77,15.14 0 bottom
IN.01  10.77,9.91 0 bottom
IN.02  10.77,10.92 0 bottom
IN.03  10.77,7.9 0 bottom
IN.04  10.77,8.92 0 bottom
L1  22.4,2.34 180 bottom
L2  25.45,3 180 bottom
M2.C1  6.91,12.19 180 bottom
M2.C2  3.68,12.19 180 bottom
M2.N1  10.77,12.98 0 bottom
M2.N2  10.77,11.96 0 bottom
M2.P1  10.77,2.84 0 bottom
M2.P2  10.77,3.96 0 bottom
M2.R1  7.49,2.79 180 bottom
M2.R2  9.14,10.41 90 top
M2.R3  6.91,13.39 0 bottom
M2.R4  4.75,0.81 180 top
M2.R5  6.91,8.51 0 bottom
M2.R6  6.91,10.92 0 bottom
M2.R7  6.91,9.78 0 bottom
M2.R8  3.68,13.39 0 bottom
M2.R9  7.92,0.81 180 top
M2.R10  4.7,5.21 0 bottom
M2.R11  1.32,5.38 90 top
M2.R12  7.29,4.19 90 top
M2.R13  6.53,6.86 0 top
M2.R14  3.35,6.86 0 top
M2.T1  2.72,9.19 180 bottom
M2.T2  4.24,9.53 0 bottom
M2.T3  30.86,4.19 0 top
M3  1.02,9.19 0 top
M4  1.02,8 0 top
N3  9.32,12.98 0 bottom
N4  9.32,11.96 0 bottom
N.C1  31.06,13.51 270 bottom
N.C2  34.09,13.51 270 bottom
N.C3  22.78,12.5 0 bottom
N.C4  22.78,9.45 0 bottom
N.D1  30.18,9.55 180 top
N.D2  34.75,10.24 180 bottom
N.D3  34.8,9.14 0 bottom
N.D4  31.45,9.75 0 bottom
N.D5  25.88,9.27 90 bottom
N.D6  28.96,3.35 0 bottom
N.D7  26.16,1.91 0 top
N.L  27.89,13.41 90 bottom
N.R1  30.89,13.31 90 top
N.R2  34.65,10.97 180 top
N.R3  28.12,10.34 0 bottom
N.R4  28.12,9.17 180 bottom
N.T1  32.61,11.07 270 top
N.T2  33.73,13 90 top
N.T3  29.21,2.41 0 top
P3  8.94,2.84 0 top
P4  8.94,3.96 0 top
Q2  39.42,10.97 90 bottom
Q3  39.42,12.5 90 bottom
Q4  34.29,3.68 90 bottom
Q5  28.75,2.03 270 bottom
R1  18.08,15.21 180 top
R2  18.08,14.07 0 top
R3  21.26,14.02 180 top
R4  21.26,15.06 0 top
R5  18.08,15.06 180 bottom
R6  21.23,15.11 180 bottom
R7  34.04,9.07 180 top
R8  37.39,12.9 180 bottom
R9  12.6,14.22 90 top
R10  11.33,14.2 270 top
R11  32,15.24 180 top
R12  29.97,8.23 180 top
R13  37.49,9.75 180 bottom
R14  37.49,11.99 180 bottom
R15  15.04,15.21 180 top
R16  37.59,10.97 180 bottom
R17  26.54,10.21 0 top
R18  15.04,14.07 0 top
R19  34.04,6.91 0 top
R20  33.78,3.86 180 top
R21  33.83,5 180 top
R22  28.24,0.81 180 bottom
R23  26.34,3.86 0 top
R24  26.34,5 0 top
R25  19.3,0.69 180 bottom
R26  22.35,0.69 180 bottom
R27  13.13,2.95 180 bottom
R28  16.23,0.71 180 bottom
R29  13.13,0.71 180 bottom
R30  13.13,1.83 180 bottom
R31  31.9,8.23 180 bottom
R32  26.57,7.75 0 top
R33  30.86,1.96 270 bottom
R34  26.42,6.35 0 top
R35  29.97,5.71 0 top
R36  33.15,1.14 0 bottom
R37  28.32,7.37 0 bottom
R38  28.32,6.22 0 bottom
R39  25.15,7.24 0 bottom
R40  25.15,6.1 0 bottom
R41  28.32,5.08 0 bottom
R42  25.15,4.7 0 bottom
RESET  10.77,4.98 0 bottom
T1  41.91,12.19 0 bottom
T2  41.83,3.86 0 bottom
T3  41.96,9.55 0 bottom
T4  41.96,6.6 0 bottom
T5  38.35,4.7 180 bottom
T6  37.97,3.17 0 bottom
T7  38.4,6.55 0 bottom
T8  32.51,1.78 0 top
T9  4.57,2.92 0 top
T10  4.57,9.14 0 top
X1  40.34,8.13 270 top
Y2  12.57,5.59 270 bottom

### Tracks (layer width: path | path; a pad name or v marks a point on that pad's centre or on a via)
+3V3  (2 unrouted)
+5V  (14 unrouted)
  Bottom 1.016: N.C4.1 N.C3.1
+24V  (22 unrouted)
  Top 0.152: IC4.4 IC4.5
AUX0H  (2 unrouted)
AUX0V  (2 unrouted)
AUX1  (2 unrouted)
AUX2  (2 unrouted)
AUX3  (2 unrouted)
AUX4  (2 unrouted)
AUX5  (2 unrouted)
  Route15 0.152: 43.69,3.86 38.41,3.86 37.59,4.57 35.56,4.57 35.36,4.88
AUX6  (1 unrouted)
AUX7  (1 unrouted)
ELKO  (2 unrouted)
ELKO.CTRL  (1 unrouted)
EMK.1A
  Top 0.152: IC1.46 15.94,13.69 R18.2 R15.1
EMK.1B
  Top 0.152: IC1.47 15.44,13.26 15.37,13.34 12.84,13.34 R9.1 11.35,13.57 R10.2
EMK.2A  (2 unrouted)
EMK.2B  (2 unrouted)
GND  (47 unrouted)
  Top 0.152: IC1.63 12.5,3.73 12.19,3.43 12.19,3.45 C5.2
  Bottom 0.152: N.C1.2 N.C2.2
GPIO.I  (7 unrouted)
LS.1  (1 unrouted)
LS.2  (1 unrouted)
M1  (4 unrouted)
M2  (4 unrouted)
M3  (4 unrouted)
M4  (4 unrouted)
M.ADC1  (5 unrouted)
MOTOR.N1  (1 unrouted)
MOTOR.N2  (1 unrouted)
MOTOR.N3  (3 unrouted)
MOTOR.N4  (3 unrouted)
MOTOR.P1  (1 unrouted)
MOTOR.P2
  Top 0.152: IC1.31 25.87,10.23 R17.1
MOTOR.P3  (3 unrouted)
MOTOR.P4  (3 unrouted)
N$1  (1 unrouted)
N$2  (1 unrouted)
N$3  (1 unrouted)
N$4  (1 unrouted)
N$5  (1 unrouted)
N$6  (1 unrouted)
N$7  (1 unrouted)
N$8  (1 unrouted)
N$9  (1 unrouted)
N$10  (1 unrouted)
N$11  (3 unrouted)
N$12  (3 unrouted)
N$13  (1 unrouted)
N$14  (2 unrouted)
N$15  (2 unrouted)
N$16  (2 unrouted)
N$17  (1 unrouted)
N$18  (1 unrouted)
N$19  (1 unrouted)
N$20  (1 unrouted)
N$21  (1 unrouted)
N$22  (1 unrouted)
N$23  (1 unrouted)
N$24  (3 unrouted)
N$25  (1 unrouted)
N$26  (1 unrouted)
N$27  (1 unrouted)
N$28  (1 unrouted)
N$29  (1 unrouted)
N$30  (3 unrouted)
N$31  (3 unrouted)
N$32  (1 unrouted)
N$33  (2 unrouted)
N$34
  Bottom 0.152: N.D5.A 25.88,10.13 26.04,10.29 27.42,10.29 N.R3.2 27.47,11.79 N.L.1
N$35  (1 unrouted)
N$36  (1 unrouted)
  Bottom 0.152: N.R4.2 N.R3.1
N$37
  Top 0.152: IC1.62 11.48,4.27 C6.1
N$38  (1 unrouted)
N$39  (1 unrouted)
N$40  (1 unrouted)
N$41  (3 unrouted)
N$42  (1 unrouted)
N$43  (1 unrouted)
N$44  (1 unrouted)
N$45  (1 unrouted)
N$46  (1 unrouted)
N$47  (1 unrouted)
N$48  (via drill 0.3)  (2 unrouted)
  Top 0.152: v26.04,14.99 26.04,14.39 IC4.6
  Bottom 0.152: N.L.2 27.89,14.78 27.69,14.99 v26.04,14.99
N$49  (2 unrouted)
N$50  (2 unrouted)
N$51  (2 unrouted)
N$52  (2 unrouted)
N$53  (2 unrouted)
N$54  (1 unrouted)
N$55  (1 unrouted)
N$56  (1 unrouted)
N$57  (1 unrouted)
N$58  (1 unrouted)
N$59  (1 unrouted)
N$60  (1 unrouted)
N$61  (1 unrouted)
N$62
  Bottom 0.152: IC6.5 23.13,3.05 L2.1
N$63
  Bottom 0.152: IC6.6 21.38,2.51 L1.1
N$64  (1 unrouted)
N$65  (1 unrouted)
N$66
  Bottom 0.152: Q5.C 27.94,2.03 27.94,3.35 N.D6.A
N$67
  Bottom 0.152: Q5.E 29.26,0.81 R22.2
N$68
  Bottom 0.152: Q5.B 29.97,2.34 R33.1
N$69  (1 unrouted)
N$70  (2 unrouted)
N$71  (1 unrouted)
N$72  (2 unrouted)
N$73  (1 unrouted)
N$74  (1 unrouted)
N$75  (1 unrouted)
N$76  (1 unrouted)
OUT.01
  Top 0.152: IC1.19 25.68,4.24 R23.1
OUT.02
  Top 0.152: IC1.20 25.42,4.74 R24.1
OUT.03  (1 unrouted)
OUT.04  (1 unrouted)
OUT.05  (1 unrouted)
OUT.06  (1 unrouted)
OUT.07  (1 unrouted)
OUT.08  (1 unrouted)
OUT.09  (1 unrouted)
OUT.10
  Top 0.152: IC1.26 25.91,7.74 R32.1
RC.ON  (1 unrouted)
RC.TX  (1 unrouted)
S/RAD  (3 unrouted)
  Bottom 1.016: D3.A D4.K
SR/SM  (3 unrouted)
  Bottom 1.016: D1.A D2.K
T1.U  (2 unrouted)
T2.U
  Top 0.152: IC1.45 16.44,13.27 16.64,13.46 16.95,13.46 R2.1 R1.2
V+  (3 unrouted)